# EasyEDA Pro project ProPrj_Syndra Version 2_2026-02-07.epro, board ControlBoard
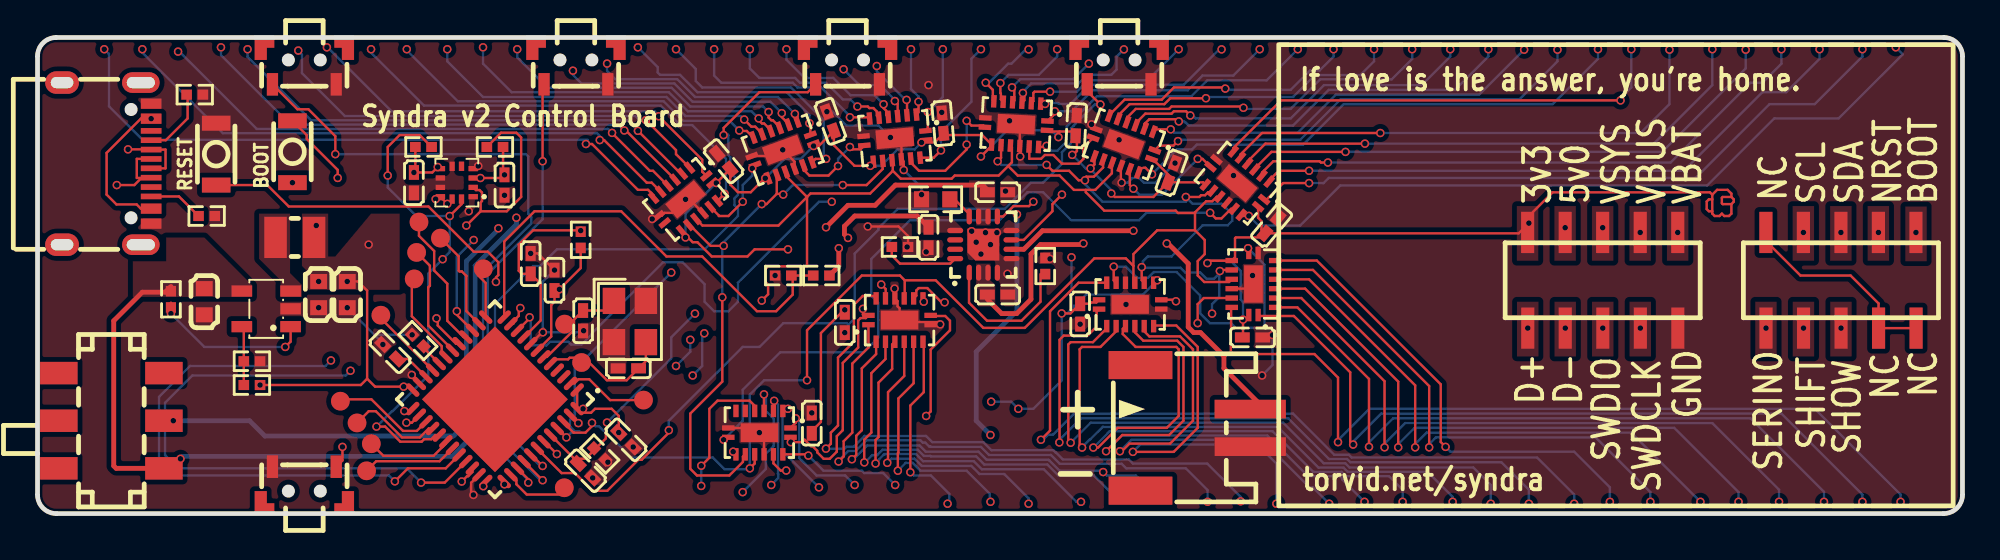
[diagram p4: board, top side]
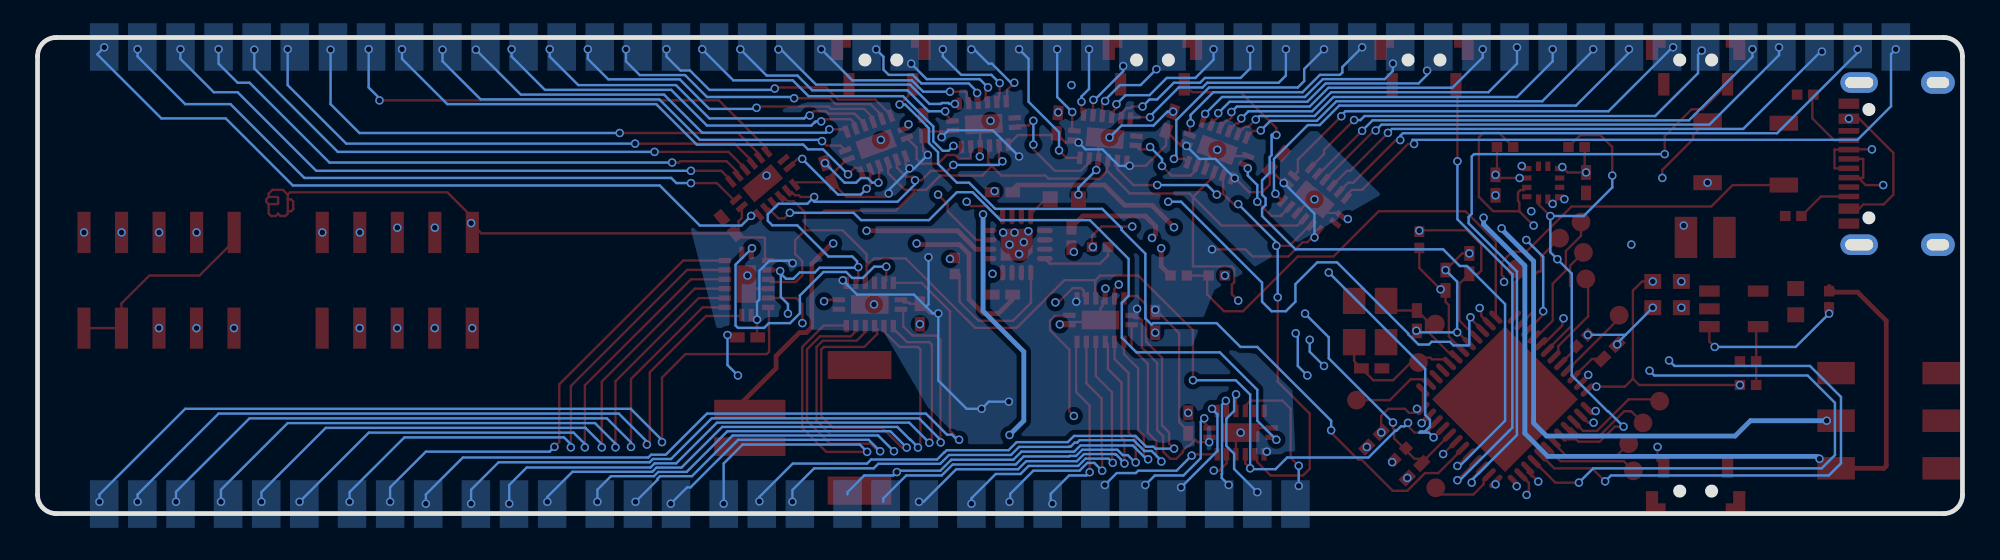
[diagram p5: board, bottom side, seen from below]

Outline 102.62 x 25.4 mm; copper layers: Top Layer, Inner1, Inner2, Bottom Layer. Coordinates in mm from the lower left corner of the outline.
Outline path: 0,24.4 0,1 arc(0.29,0.29) 1,0 101.62,0 arc(102.32,0.29) 102.62,1 102.62,24.4 arc(102.32,25.11) 101.62,25.4 1,25.4 arc(0.29,25.11) 0,24.4
Stack: Top Layer 0.035mm Outer layer thickness 1oz / Dielectric1 0.2104mm 7628 RC49% 8.6mil / Inner1 0.0152mm Inner layer thickness / Dielectric2 1.065mm 1.1mm H/HOZ Copper / Inner2 0.0152mm Inner layer thickness / Dielectric3 0.2104mm 7628 RC49% 8.6mil / Bottom Layer 0.035mm Outer layer thickness 1oz

## Design rules (mm)
template: Custom Config
spacing copperThickness1oz (default): track to track 0.102, other pairs 0.152 to 0.3
spacing copperThickness2oz: track to track 0.203, other pairs 0.152 to 0.3
spacing copperThicknessInner0.5oz: track to track 0.089, other pairs 0.152 to 0.3
track width copperThickness1oz (default): min 0.102, default 0.254, max 2.54
track width copperThickness2oz: min 0.203, default 0.254, max 2.54
track width copperThickness0.5oz: min 0.089, default 0.254, max 2.54
differential pair differentialPair (default): width min 0.127, default 0.254, max 2.54; gap min 0.152, default 0.152
via viaSize (default): diameter min 0.3, default 0.61, max 10; hole min 0.2, default 0.305, max 6.3
pour e13157 uses copperRegion

## Placement (name value [footprint] x y rotation side)
BOOT  GT-TC024A-H0060-L1  [SW-SMD_L3.0-W2.0-LS3.5]  13.59 19.3 90 top
C28  22uF  [C0603]  14.99 11.68 90 top
C29  22uF  [C0603]  16.51 11.68 90 top
C30  22uF  [C0603]  8.89 11.3 90 top
C36  10uF  [C0402]  43.03 10.2 90 top
C37  10uF  [C0402]  55.58 10.65 90 top
C38  10uF  [C0402]  41.28 4.83 270 top
C39  10uF  [C0402]  64.77 9.4 180 top
C40  10uF  [C0402]  36.58 18.8 310 top
C41  10uF  [C0402]  42.27 20.93 290 top
C42  10uF  [C0402]  48.26 20.83 275 top
C43  10uF  [C0402]  55.37 20.7 267.1 top
C44  10uF  [C0402]  60.45 18.19 250 top
C45  10uF  [C0402]  65.79 15.37 230 top
C50  2.2uF  [C0402]  18.8 8.64 315 top
C53  14pF  [C0402]  29.08 10.29 270 top
C54  14pF  [C0402]  31.5 7.75 180 top
C57  100nF  [C0402]  26.29 13.34 90 top
C60  100nF  [C0402]  31.37 3.94 315 top
C61  100nF  [C0402]  27.56 12.45 270 top
C62  100nF  [C0402]  29.21 2.29 315 top
C66  100nF  [C0402]  20.07 17.65 90 top
C67  100nF  [C0402]  24.89 17.53 90 top
C69  10uF  [C0402]  51.18 17.15 180 top
C70  10uF  [C0402]  47.5 14.73 270 top
C71  10uF  [C0402]  51.18 11.68 180 top
CN1  S2B-PH-SM4-TB(LF)(SN)  [CONN-SMD_P2.00_S2B-PH-SM4-TB-LF-SN]  61.72 4.57 270 top
IC1  TLV62569DBVR  [SOT-23-5_L3.0-W1.7-P0.95-LS2.8-BR]  12.19 10.92 0 top
L1  2.2uH  [IND-SMD_L2.5-W2.0]  13.72 14.73 0 top
P1  2.0-2*5P立贴母  [HDR-SMD_10P-P2.00-V-F-R2-C5-S2.00-LS6.0]  83.44 12.45 90 top
P2  2.0-2*5P立贴母  [HDR-SMD_10P-P2.00-V-F-R2-C5-S2.00-LS6.0]  96.14 12.45 90 top
R99  68kΩ  [R0402]  11.43 6.86 0 top
R100  15kΩ  [R0402]  11.43 8.13 180 top
R101  100kΩ  [R0402]  7.11 11.43 270 top
R115  10kΩ  [R0402]  28.96 14.61 90 top
R116  10kΩ  [R0402]  29.97 3.18 315 top
R117  10kΩ  [R0402]  20.28 9.23 315 top
R121  5.1kΩ  [R0402]  8.38 22.35 0 top
R122  5.1kΩ  [R0402]  9.02 15.88 0 top
R123  10kΩ  [R0402]  41.78 12.7 0 top
R124  10kΩ  [R0402]  39.75 12.7 0 top
R125  5.1kΩ  [R0402]  24.38 19.56 0 top
R126  5.1kΩ  [R0402]  20.57 19.56 180 top
R129  3kΩ  [R0603]  47.88 16.76 0 top
R130  4.7kΩ  [R0402]  45.97 14.22 180 top
R131  10kΩ  [R0402]  53.72 13.21 90 top
RESET  GT-TC024A-H0060-L1  [SW-SMD_L3.0-W2.0-LS3.5]  9.53 19.18 90 top
SW1  K3-2245S-L1  [SW-TH_K3-2245S-L1]  3.94 4.95 180 top
SW2  TS24CA  [SW-SMD_TS24CA]  14.22 23.88 0 top
SW3  TS24CA  [SW-SMD_TS24CA]  28.7 23.88 0 top
SW4  TS24CA  [SW-SMD_TS24CA]  43.18 23.88 0 top
SW5  TS24CA  [SW-SMD_TS24CA]  57.66 23.88 0 top
SW6  TS24CA  [SW-SMD_TS24CA]  14.22 1.52 180 top
TP10  -  [Test-Point-0.5mm]  17.03 4.84 0 top
TP11  -  [Test-Point-0.5mm]  16.14 5.99 0 top
TP12  -  [Test-Point-0.5mm]  18.3 10.58 0 top
TP13  -  [Test-Point-0.5mm]  20.08 12.52 0 top
TP14  -  [Test-Point-0.5mm]  20.21 13.93 0 top
TP15  -  [Test-Point-0.5mm]  28.08 1.38 0 top
TP16  -  [Test-Point-0.5mm]  17.54 2.28 0 top
TP19  -  [Test-Point-0.5mm]  17.8 3.73 0 top
TP20  -  [Test-Point-0.5mm]  20.33 15.55 0 top
TP21  -  [Test-Point-0.5mm]  21.48 14.7 0 top
TP22  -  [Test-Point-0.5mm]  23.76 13.06 0 top
TP23  -  [Test-Point-0.5mm]  29 8.06 0 top
TP24  -  [Test-Point-0.5mm]  28.1 10.11 0 top
TP25  -  [Test-Point-0.5mm]  32.31 6.05 0 top
U80  RS595SXTQW16  [DHVQFN-16_L3.5-W2.5-P0.50-BL-EP]  64.82 12.25 90 top
U81  RS595SXTQW16  [DHVQFN-16_L3.5-W2.5-P0.50-BL-EP]  58.25 11.16 0 top
U82  RS595SXTQW16  [DHVQFN-16_L3.5-W2.5-P0.50-BL-EP]  45.95 10.32 0 top
U83  RS595SXTQW16  [DHVQFN-16_L3.5-W2.5-P0.50-BL-EP]  38.48 4.32 180 top
U84  RS595SXTQW16  [DHVQFN-16_L3.5-W2.5-P0.50-BL-EP#2]  63.96 17.63 140 top
U85  RS595SXTQW16  [DHVQFN-16_L3.5-W2.5-P0.50-BL-EP#3]  57.91 19.71 160 top
U86  RS595SXTQW16  [DHVQFN-16_L3.5-W2.5-P0.50-BL-EP]  52.17 20.78 177.1 top
U87  RS595SXTQW16  [DHVQFN-16_L3.5-W2.5-P0.50-BL-EP]  45.7 20.03 185 top
U88  STM32F411CEU6  [UFQFPN-48_L7.0-W7.0-P0.50-BL-EP]  24.38 6.1 135 top
U90  RS595SXTQW16  [DHVQFN-16_L3.5-W2.5-P0.50-BL-EP#2]  39.73 19.41 200 top
U91  RS595SXTQW16  [DHVQFN-16_L3.5-W2.5-P0.50-BL-EP#3]  34.54 16.76 220 top
U92  KXTJ3-1057  [LGA-12_L2.0-W2.0-P0.50-BL]  22.35 17.65 90 top
U93  BQ24074RGTR  [QFN-16_L3.0-W3.0-P0.50-TL-EP1.7]  50.42 14.35 90 top
USB1  TYPE-C 16PIN 2MD(073)  [USB-C-SMD_TYPE-C-6PIN-2MD-073]  3.68 18.67 270 top
X1  24MHz  [CRYSTAL-SMD_4P-L3.2-W2.5-BL]  31.58 10.25 270 top

## Footprints (pads in the part's own frame, mm; a bottom-side part is the same pattern mirrored in y, then rotated)
C0402
  rect 0.79x0.54 smd: 1(-0.545,0) 2(0.545,0)
C0603
  rect 0.8x0.9 smd: 1(-0.7,0) 2(0.7,0)
CONN-SMD_P2.00_S2B-PH-SM4-TB-LF-SN
  rect 1x3.8 smd: 1(-1,2.925) 2(1,2.925)
  rect 1.5x3.4 smd: 3(3.35,-2.925) 4(-3.35,-2.925)
CRYSTAL-SMD_4P-L3.2-W2.5-BL
  rect 1.4x1.2 smd: 1(-1.1,-0.85) 2(1.1,-0.85) 3(1.1,0.85) 4(-1.1,0.85)
DHVQFN-16_L3.5-W2.5-P0.50-BL-EP
  rect 0.665x0.28 smd: 1(-1.657,-0.25) 8(1.657,-0.25) 9(1.657,0.25) 16(-1.657,0.25)
  rect 0.28x0.665 smd: 2(-1.25,-1.157) 3(-0.75,-1.157) 4(-0.25,-1.157) 5(0.25,-1.157) 6(0.75,-1.157) 7(1.25,-1.157) 10(1.25,1.157) 11(0.75,1.157) 12(0.25,1.157) 13(-0.25,1.157) 14(-0.75,1.157) 15(-1.25,1.157)
  rect 2x1 smd: 17(0,0)
DHVQFN-16_L3.5-W2.5-P0.50-BL-EP#2
  rect 0.665x0.28 smd: 1(-1.657,-0.25) 8(1.657,-0.25) 9(1.657,0.25) 16(-1.657,0.25)
  rect 0.28x0.665 smd: 2(-1.25,-1.157) 3(-0.75,-1.157) 4(-0.25,-1.158) 5(0.25,-1.157) 6(0.75,-1.157) 7(1.25,-1.157) 10(1.25,1.157) 11(0.75,1.157) 12(0.25,1.158) 13(-0.25,1.157) 14(-0.75,1.157) 15(-1.25,1.157)
  rect 2x1 smd: 17(0,0)
DHVQFN-16_L3.5-W2.5-P0.50-BL-EP#3
  rect 0.665x0.28 smd: 1(-1.657,-0.25) 8(1.657,-0.25) 9(1.657,0.25) 16(-1.657,0.25)
  rect 0.28x0.665 smd: 2(-1.25,-1.157) 3(-0.75,-1.157) 4(-0.25,-1.157) 5(0.25,-1.157) 6(0.75,-1.157) 7(1.25,-1.157) 10(1.25,1.157) 11(0.75,1.157) 12(0.25,1.157) 13(-0.25,1.157) 14(-0.75,1.157) 15(-1.25,1.157)
  rect 2x1 smd: 17(0,0)
HDR-SMD_10P-P2.00-V-F-R2-C5-S2.00-LS6.0
  rect 2.2x0.7 smd: 1(-2.552,3.997) 2(2.552,4.003) 3(-2.552,1.997) 4(2.552,2.003) 5(-2.552,-0.003) 6(2.552,0.003) 7(-2.552,-2.003) 8(2.552,-1.997) 9(-2.552,-4.003) 10(2.552,-3.997)
IND-SMD_L2.5-W2.0
  rect 1.2x2.2 smd: 1(1.028,0) 2(-1.028,0)
LGA-12_L2.0-W2.0-P0.50-BL
  rect 0.28x0.5 smd: 1(-0.75,-0.875) 2(-0.25,-0.875) 3(0.25,-0.875) 4(0.75,-0.875) 7(0.75,0.875) 8(0.25,0.875) 9(-0.25,0.875) 10(-0.75,0.875)
  rect 0.5x0.28 smd: 5(0.875,-0.25) 6(0.875,0.25) 11(-0.875,0.25) 12(-0.875,-0.25)
QFN-16_L3.0-W3.0-P0.50-TL-EP1.7
  oval 0.85x0.28 smd: 1(-1.5,0.75) 2(-1.5,0.25) 3(-1.5,-0.25) 4(-1.5,-0.75) 9(1.5,-0.75) 10(1.5,-0.25) 11(1.5,0.25) 12(1.5,0.75)
  oval 0.28x0.85 smd: 5(-0.75,-1.5) 6(-0.25,-1.5) 7(0.25,-1.5) 8(0.75,-1.5) 13(0.75,1.5) 14(0.25,1.5) 15(-0.25,1.5) 16(-0.75,1.5)
  custom 1.7x1.7 smd: 17(0,0)
R0402
  rect 0.566x0.54 smd: 1(-0.433,0) 2(0.433,0)
R0603
  rect 0.806x0.864 smd: 1(-0.753,0) 2(0.753,0)
SOT-23-5_L3.0-W1.7-P0.95-LS2.8-BR
  rect 1.1x0.6 smd: 1(1.3,-0.95) 2(1.3,0) 3(1.3,0.95) 4(-1.3,0.95) 5(-1.3,-0.95)
SW-SMD_L3.0-W2.0-LS3.5
  rect 0.8x1.524 smd: 1(-1.651,0) 2(1.651,0)
SW-SMD_TS24CA
  custom 1.05x1.3 smd: 1(-2.125,0.975) 2(2.125,0.975)
  rect 0.6x1.2 smd: 3(-1.7,-0.975) 4(1.7,-0.975)
SW-TH_K3-2245S-L1
  rect 2x1.2 smd: 1(-2.8,2.54) 2(-2.8,0) 3(-2.8,-2.54) 4(2.8,-2.54) 5(2.8,0) 6(2.8,2.54)
Test-Point-0.5mm
  round 1 smd: 1(0,0)
UFQFPN-48_L7.0-W7.0-P0.50-BL-EP
  oval 0.28x0.9 smd: 1(-2.751,-3.45) 2(-2.251,-3.45) 3(-1.75,-3.45) 4(-1.25,-3.45) 5(-0.749,-3.45) 6(-0.249,-3.45) 7(0.249,-3.45) 8(0.75,-3.45) 9(1.25,-3.45) 10(1.75,-3.45) 11(2.251,-3.45) 12(2.751,-3.45) 25(2.751,3.449) 26(2.251,3.449) 27(1.75,3.449) 28(1.25,3.449) 29(0.75,3.449) 30(0.249,3.449) 31(-0.249,3.449) 32(-0.749,3.449) 33(-1.25,3.449) 34(-1.75,3.449) 35(-2.251,3.449) 36(-2.751,3.449)
  oval 0.9x0.28 smd: 13(3.45,-2.751) 14(3.45,-2.251) 15(3.45,-1.75) 16(3.45,-1.25) 17(3.45,-0.75) 18(3.45,-0.249) 19(3.45,0.249) 20(3.45,0.749) 21(3.45,1.25) 22(3.45,1.75) 23(3.45,2.251) 24(3.45,2.751) 37(-3.449,2.751) 38(-3.449,2.251) 39(-3.449,1.75) 40(-3.449,1.25) 41(-3.449,0.749) 42(-3.449,0.249) 43(-3.449,-0.249) 44(-3.449,-0.75) 45(-3.449,-1.25) 46(-3.449,-1.75) 47(-3.449,-2.251) 48(-3.449,-2.751)
  rect 5.5x5.5 smd: 49(0,0)
USB-C-SMD_TYPE-C-6PIN-2MD-073
  rect 0.55x1.1 smd: 1(-3.2,2.375) 2(-2.4,2.375) 11(2.4,2.375) 12(3.2,2.375)
  rect 0.3x1.1 smd: 3(-1.75,2.375) 4(-1.25,2.375) 5(-0.75,2.375) 6(-0.25,2.375) 7(0.25,2.375) 8(0.75,2.375) 9(1.25,2.375) 10(1.75,2.375)
  oval 1.1x2 hole 0.6x1.5: 13(-4.325,1.825) 14(4.325,1.825)
  oval 1.2x1.8 hole 0.6x1.2: 13(-4.325,-2.375) 14(4.325,-2.375)

## Nets
As in the schematic.

Pads without a net: CN1 3 4; P2 2 7 9; SW1 3 4 5 6; SW2 1 2; SW3 1 2; SW4 1 2; SW5 1 2; SW6 1 2; U88 3 4 49; U91 9; U92 5; U93 14 15; USB1 3 9 13 14

## Via types
v1: diameter 0.45, hole 0.3, Top Layer to Bottom Layer, 361 vias

## Routing (per net, layer and track width the routed paths; a pad name or vN(x,y) marks a point on that pad's centre or on a via; arc(x,y) is an arc through that point)
3.3V: length 227
  Top Layer w0.127: v1(28.96,15.1) 28.94,15.11 26.42,15.11 25.65,14.35 25.65,12.95 25.82,12.79 C57.1 26.82,12.26 26.82,10.3 U88.9 ; 79.44,15.43 78.96,14.95 C45.2 ; 79.44,15.43 P1.2 ; 79.44,15.43 v1(79.5,15.49) ; 79.44,15.43 79.44,15.81 80.77,17.14 89.15,17.14 89.28,17.01 ; v1(64.26,10.35) 64.26,9.44 64.22,9.4 ; v1(44,10.92) 44,10.61 44.04,10.57 U82.16 44.15,10.43 43.87,10.43 43.75,10.3 43.75,8.86 42.93,8.04 42.93,4.45 42.61,4.13 42.61,3.3 42.23,2.92 41.91,2.92 41.56,3.27 41.56,3.35 41.32,3.59 41.24,3.59 40.89,3.94 40.77,3.81 v1(40.16,3.81) ; v1(50.29,19.05) 50.86,19.62 U86.10 50.36,20.19 48.4,20.19 48.31,20.29 47.82,19.8 v1(47.12,19.8) ; U91.16 v1(36.19,17.64) C40.2 36.93,17.56 37.34,17.15 38.02,17.15 38.77,17.89 v1(38.79,17.89) ; 54.5,20.38 53.92,20.38 53.91,20.38 53.88,20.38 U86.16 ; 54.5,20.38 54.42,20.31 v1(54.42,20.08) ; 54.5,20.38 55.12,20.38 55.41,20.09 55.41,19.34 55.25,19.18 55.12,19.18 ; v1(59.69,12.45) 59.63,12.45 U81.10 ; 34.33,15.07 34.93,14.48 35.18,14.48 35.94,13.72 37.85,13.72 38.23,14.1 v1(40,14.1) ; v1(11.86,6.86) 17.23,6.86 17.57,7.19 ; 89.28,17.01 89.53,17.27 90.1,17.27 90.3,17.07 90.3,16.89 ; 89.28,17.01 89.28,16.76 ; 90.3,16.89 90.42,16.76 90.42,16.64 90.3,16.51 ; 90.3,16.89 89.83,16.89 89.79,16.85 89.79,16.56 89.83,16.51 90.3,16.51 ; v1(62.36,13.36) 62.49,13.49 63.65,13.49 U80.10 63.84,13.67 63.84,14.69 63.88,14.73 65.22,14.73 C45.2 ; 54.42,20.21 54.37,20.21 54.36,20.2 ; 89.28,16.13 89.1,16.13 88.98,16.24 88.98,16.65 89.1,16.76 89.28,16.76 ; 89.28,16.13 89.28,16.01 89.41,15.88 89.66,15.88 89.79,16 89.92,15.88 90.17,15.88 90.3,16 90.3,16.51 ; 89.28,16.13 89.28,16.76 ; v1(56.13,18.42) 56.34,18.62 U85.10 ; v1(19.52,6.77) 17.99,6.77 17.57,7.19 ; R125.2 24.82,18.15 v1(24.89,18.07) 24.72,17.9 v1(23.61,17.9) ; C45.2 65.25,15.14 65.25,15.6 65.07,15.78 U84.16 ; v1(21.85,16.52) 21.6,16.78 v1(21.22,16.78) ; U85.16 59.39,18.92 59.45,18.92 60.48,17.89 60.52,17.93 ; R126.2 20.14,18.27 v1(20.07,18.2) 21.04,18.2 v1(21.33,18.49) ; U88.1 U88.48 28.99,5.38 29.51,5.38 29.72,5.59 30.61,5.59 30.99,5.21 30.99,4.33 v1(30.98,4.32) ; 17.57,7.19 17.57,11.89 17.08,12.38 v1(16.51,12.38) ; v1(44.39,18.55) 43.55,18.55 42.45,19.65 C41.2 41.65,19.61 v1(41.37,19.61) ; U81.16 56.44,11.26 56.17,11.26 56.1,11.19 C37.2 55.06,10.68 v1(54.6,10.68) ; v1(57.24,17.08) 57.43,16.89 59.48,16.89 C44.2 62.13,17.67 U84.10 ; C38.2 41.28,4.4 41.76,4.89 41.76,9.63 43,10.87 v1(43.03,10.87)
  Inner1 w0.127: v1(44,10.92) 44,10.98 44.07,11.05 46.48,11.05 46.74,11.3 v1(47.24,11.3) ; v1(34.54,14.73) 29.32,14.73 v1(28.96,15.1) ; v1(59.69,12.45) 61.45,12.45 v1(62.36,13.36) ; v1(37.08,3.3) 39.65,3.3 v1(40.16,3.81) ; v1(55.12,13.67) 54.69,14.1 53.78,14.1 53.72,14.03 52.32,14.03 50.87,12.57 49.97,12.57 48.14,14.4 47.19,14.4 46.5,13.72 40.39,13.72 v1(40,14.1)
  Inner1 w0.254: v1(13.59,17.65) 14.86,16.38 v1(14.86,15.37)
  Inner2 w0.127: v1(24.89,18.07) 25.98,18.07 v1(28.96,15.1) ; 27.89,5.59 26.71,6.77 22.33,6.77 19.93,4.37 19.53,4.37 18.97,4.92 18.97,5.76 19.52,6.31 v1(19.52,6.77) ; 27.89,5.59 v1(29.08,5.59) ; 27.89,5.59 v1(23.76,1.46)
  Bottom Layer w0.127: v1(62.36,13.36) 62.49,13.49 63.6,13.49 64.13,12.95 64.13,11.42 64.26,11.29 v1(64.26,10.35) ; v1(47.12,19.8) 46.76,19.43 45.85,19.43 44.97,18.55 v1(44.39,18.55) ; v1(54.42,20.08) 54.06,20.45 51.69,20.45 v1(50.29,19.05) ; v1(50.84,5.97) 51.91,5.97 v1(52.29,5.59) 53.09,5.59 54.6,7.1 v1(54.6,10.68) 54.89,10.68 55.25,11.03 ; v1(36.19,17.64) 36.18,17.64 34.54,16 v1(34.54,14.73) ; v1(55.16,19.14) 55.88,18.42 v1(56.13,18.42) 56.13,18.37 57.24,17.26 v1(57.24,17.08) ; 55.25,11.03 55.12,11.16 v1(55.12,13.67) ; 55.25,11.03 55.9,11.68 58.93,11.68 v1(59.69,12.45) ; v1(38.79,17.89) 39.83,18.92 40.68,18.92 v1(41.37,19.61)
  vias: v1(14.99,12.38) v1(17.65,14.35)
5.0V: length 114.2
  Top Layer w0.254: SW1.1 4.19,2.41 4.06,2.54 4.06,10.29 5.59,11.81 6.81,11.81 7.11,12.12
  Inner1 w0.254: v1(25.53,15.78) 26,16.26 33.66,16.26 34.04,15.88 42.54,15.88 43.14,16.47 51.7,16.47 v1(52.21,15.96) 52.38,16.13 59.93,16.13 60.18,15.88 61.24,15.88 62.25,16.89 66.93,16.89 68.16,15.66 76.17,15.66 76.84,14.99 81.17,14.99 v1(81.44,15.25)
  Bottom Layer w0.254: v1(25.53,15.78) 25.53,15.42 23.33,13.23 23.33,4.28 22.1,3.05 7.75,3.05 v1(7.62,2.92) ; v1(52.21,15.96) 52.21,10.81 50.04,8.64 50.04,4.95 v1(50.8,4.19)
GND: length 75.5
  Top Layer w0.127: v1(46.18,18.33) 46.18,18.56 46.17,18.57 46.17,18.78 46.05,18.9 46.05,19.68 U87.17 ; v1(52.38,19.05) 52.38,19.59 U86.13 52.36,20.59 U86.17 ; v1(26.29,13.88) 26.67,13.88 v1(27.56,12.99) ; U91.8 33.28,15.89 33.43,16.04 33.82,16.04 v1(34.54,16.76) 34.75,16.76 U91.13 ; U82.13 45.85,11.34 45.85,11.06 45.95,10.95 U82.17 46.06,10.22 47.99,10.22 v1(48.12,10.09) ; v1(26.94,9.67) 26.9,9.67 26.29,9.07 ; v1(23.24,0.99) 23.24,1.02 23.11,1.14 23.11,1.64 U88.35 ; 46.41,14.22 46.41,14.81 45.9,15.32 v1(44.26,15.32) ; U83.8 38.23,4.57 v1(38.48,4.32) 38.73,4.07 U83.13 ; 57.75,18.54 57.75,17.69 v1(57.79,17.65) ; U88.23 20.35,7 v1(19.95,7.4) ; U80.13 64.57,12 U80.17 ; U90.13 40.36,18.78 v1(39.73,19.41) 39.39,19.07 U90.8
  Inner1 w0.127: v1(47.5,22.86) 47.5,22.01 47.9,21.61 47.9,21.24 47.64,20.98 46.38,20.98 v1(45.47,20.07) ; v1(52.38,19.05) 52.38,17.99 v1(51.6,17.2) ; v1(31.75,3.55) 30.94,2.74 v1(30.41,2.74) 30.41,3.25 v1(28.83,4.83)
  Inner2 w0.127: v1(47.13,17.02) 47.13,14.21 v1(47.37,13.96) 46.62,13.96 ; 46.62,13.96 45.69,13.03 v1(45.69,12) ; 46.62,13.96 v1(46.35,14.22) ; v1(58.03,11.16) 56.97,10.1 v1(55.58,10.1) 55.58,11.98 v1(53.97,13.59) 53.18,12.79 v1(51.71,12.79)
  Bottom Layer w0.127: v1(65.84,9.53) 65.84,7.92 v1(65.28,7.37) ; v1(18.41,9.02) 18.41,9.08 17.96,9.54 ; v1(27.56,12.99) 26.94,12.37 v1(26.94,9.67) 29.03,9.67 v1(29.11,9.75) ; v1(16.51,10.98) 17.96,9.54 ; 17.96,9.54 v1(19.97,9.54) ; v1(57.79,17.65) 58.12,17.65 58.36,17.9 58.73,17.9 58.98,17.65 59.59,17.65 v1(60.64,18.7) ; v1(46.18,18.33) 47.13,17.38 v1(47.13,17.02) ; v1(42.08,21.44) 42.38,21.44 43.12,20.7 44.83,20.7 v1(45.47,20.07)
  vias: v1(14.99,10.98) v1(22.99,16.13) v1(23.5,18.54) v1(24.89,16.98) v1(29.6,1.9) v1(32.77,15.72) v1(39.32,12.7) v1(41.28,5.37) v1(43.03,9.65) v1(48.2,21.41) v1(49.8,15.07) v1(50.04,14.48) v1(50.29,13.84) v1(50.53,14.99) v1(50.8,14.35) v1(51.14,14.99) v1(51.82,20.96) v1(56.19,20.77) v1(57.66,19.94) v1(63.75,18.03) v1(64.77,12.7)
VBAT: length 70
  Top Layer w0.254: 50.64,11.43 51.4,10.67 52.2,10.67 52.96,11.43 52.96,13.84 53.47,14.35 55.69,14.35 v1(55.75,14.41) ; v1(42.72,14.16) 42.72,13.2 R123.2 ; 66.04,5.57 65.42,5.57 63.25,7.75 63.25,8.41 62,9.66 61.64,9.66 61.34,9.95 61.34,13.34 60.27,14.41 v1(60.2,14.41)
  Inner1 w0.254: v1(42.72,14.16) 42.77,14.1 45.21,14.1 45.85,14.73 48.23,14.73 50,12.95 50.83,12.95 52.29,14.41 v1(55.75,14.41) v1(60.2,14.41) 60.39,14.61 63.5,14.61 63.88,14.99 65.91,14.99 66.93,13.97 75.44,13.97 76.19,13.22 85.66,13.22 v1(87.44,15)
VBUS: length 110.4
  Top Layer w0.127: USB1.11 5.51,16.27 5.28,16.49 4.21,16.49 3.68,17.02 3.68,19.25 5.51,21.07 v1(6.06,21.07)
  Top Layer w0.254: v1(58.42,15.09) 53.57,15.09 52.58,14.1 U93.6 ; v1(43.21,14.71) 43.01,14.9 43.01,15.33 43.56,15.88 46.9,15.88 C70.1
  Inner1 w0.127: 5.97,21.08 6.07,21.08 v1(6.06,21.07)
  Inner1 w0.254: 6.07,21.08 15.49,21.08 16.26,20.32 17.02,20.32 17.22,20.12 25.09,20.12 25.4,19.81 25.4,16.76 23.88,15.24 23.88,14.99 24.24,14.62 28.05,14.62 28.45,14.22 34.8,14.22 35.43,14.86 41.7,14.86 41.85,14.71 v1(43.21,14.71) 43.43,14.48 44.83,14.48 45.72,15.37 46.86,15.37 47.12,15.62 51.31,15.62 51.85,15.09 v1(58.42,15.09) 58.52,14.99 62.99,14.99 63.37,15.37 66.8,15.37 67.69,14.48 76.07,14.48 76.84,13.72 84.15,13.72 v1(85.44,15)
(no net): length 11.2
  Top Layer w0.127: P2.9 P2.7 98.14,11.21 96.65,12.7 93.98,12.7 92.14,14.54 P2.2
ACC_SCL: length 102.5
  Top Layer w0.127: R126.1 20.37,20.19 19.3,20.19 18.67,19.56 v1(18.67,18.03) ; U92.12 22.6,16.51 v1(21.97,15.88) ; U88.29 21.21,4.19 20.99,3.97 20.61,3.97 20.47,3.84 19.34,3.84 18.53,4.64 v1(18.07,4.64)
  Inner1 w0.127: v1(21.6,13.57) 25.98,13.57 26.11,13.44 26.47,13.44 26.6,13.57 28.59,13.57 28.86,13.3 35.22,13.3 35.38,13.46 48.76,13.46 49.9,12.32 52.83,12.32 52.83,12.32 53.55,12.32 54.24,13.01 55.74,13.01 56.57,13.84 61.53,13.84 61.71,14.03 63,14.03 63.59,13.44 74.96,13.44 75.56,12.83 92.42,12.83 94.14,14.54 v1(94.14,15)
  Bottom Layer w0.127: v1(18.67,18.03) 18.67,17.4 20.19,15.88 v1(21.97,15.88) 21.97,13.95 v1(21.6,13.57) 20.83,12.8 20.83,7.37 18.92,5.46 18.89,5.46 v1(18.07,4.64)
ACC_SDA: length 105.2
  Top Layer w0.127: 23.62,16.13 25.02,16.13 25.78,16.89 25.78,20.07 25.53,20.32 24.71,20.32 R125.1 ; 23.62,16.13 23.62,16.55 ; 23.62,16.13 v1(22.86,15.37) ; 27.71,4.54 27.72,4.54 v1(28.19,4.06) ; 23.62,16.6 23.69,16.67 23.69,17.13 23.57,17.26 23.37,17.26 U92.2
  Inner1 w0.127: 33.69,12.95 v1(33.78,12.86) ; 33.69,12.95 33.54,12.8 28.21,12.8 27.85,12.45 25.78,12.45 25.15,13.08 21.46,13.08 21.08,13.46 21.08,14.73 21.72,15.37 v1(22.86,15.37) ; 33.69,12.95 35.43,12.95 35.71,13.23 48.66,13.23 49.83,12.07 52.9,12.07 52.93,12.09 54.41,12.09 54.89,12.57 55.63,12.57 56.67,13.61 61.62,13.61 61.81,13.8 62.91,13.8 63.5,13.21 65.91,13.21 66.04,13.08 74.29,13.08 74.8,12.57 93.71,12.57 v1(96.14,15)
  Bottom Layer w0.127: v1(28.19,4.06) 28.45,4.32 28.96,4.32 28.89,4.39 28.65,4.39 28.39,4.64 28.39,5.01 28.65,5.27 28.65,5.4 28.64,5.41 28.64,7.72 v1(33.78,12.86)
B0: length 37.4
  Top Layer w0.127: U80.2 67.16,11 70.98,7.18 v1(70.98,3.56)
  Bottom Layer w0.127: v1(95.23,0.63) 95.23,1.16 91.31,5.08 72.26,5.08 70.98,3.8 v1(70.98,3.56)
B1: length 30.3
  Top Layer w0.127: U80.5 67.78,12.5 73.44,6.84 v1(73.44,3.53)
  Bottom Layer w0.127: v1(73.44,3.53) 73.44,3.72 74.04,4.32 84.96,4.32 v1(88.65,0.63)
B2: length 42
  Top Layer w0.127: U81.15 55.49,12.31 53.97,10.8 53.97,4.42 v1(53.49,3.94)
  Bottom Layer w0.127: v1(81.91,0.53) 81.91,1.02 79.94,2.99 70.05,2.99 69.91,3.14 69.12,3.14 66.93,5.33 55.26,5.33 54.13,4.21 53.87,4.21 53.6,3.94 v1(53.49,3.94)
B3: length 29.9
  Top Layer w0.127: v1(55.68,3.52) 55.55,3.65 55.55,8.76 55.68,8.89 56.66,8.89 57.5,9.72 U81.3
  Bottom Layer w0.127: v1(75.44,0.63) 75.44,0.89 74.1,2.23 69.84,2.23 69.62,2.45 68.29,2.45 66.12,4.62 56.78,4.62 56.12,3.96 56.1,3.96 55.68,3.54 v1(55.68,3.52)
B4: length 24.3
  Top Layer w0.127: 58.93,9.75 58.97,9.75 59.27,9.45 60.91,9.45 61.59,8.76 61.59,4.95 60.37,3.73 58.21,3.73 57.8,3.32 v1(57.7,3.32)
  Bottom Layer w0.127: v1(68.86,0.53) 67.99,1.4 67.81,1.4 65.27,3.94 58.31,3.94 v1(57.7,3.32)
B5: length 29.9
  Top Layer w0.127: U82.1 44.3,8.86 43.43,8 43.43,4.32 42.97,3.86 42.97,3.05 v1(42.7,2.78)
  Bottom Layer w0.127: v1(42.7,2.78) 42.7,2.82 43.22,3.34 43.61,3.34 44.18,3.91 47.06,3.91 47.19,3.79 47.33,3.79 47.53,3.58 47.6,3.58 47.62,3.56 50.29,3.56 50.72,3.13 54.02,3.13 54.5,2.66 57.8,2.66 58.04,2.41 61.21,2.41 62.37,1.25 v1(62.37,0.63)
B6: length 19.2
  Top Layer w0.127: v1(44.68,2.67) 44.68,3.92 44.83,4.08 44.83,6.98 45.56,7.71 45.56,9.02 U82.4
  Bottom Layer w0.127: v1(55.63,0.63) 55.38,0.63 53.64,2.36 50.34,2.36 49.91,2.79 47.21,2.79 46.83,3.18 45.18,3.18 45.15,3.15 45.12,3.15 44.86,2.89 44.86,2.85 v1(44.68,2.67)
B7: length 10.4
  Top Layer w0.127: U82.7 47.24,9.13 47.24,6.48 46.53,5.76 v1(46.53,2.21)
  Bottom Layer w0.127: v1(46.53,2.21) 46.7,2.03 47.62,2.03 48.61,1.05 48.61,0.62 v1(48.51,0.53)
B8: length 5.4
  Top Layer w0.127: U83.2 39.84,5.59 v1(40,5.59)
  Bottom Layer w0.127: v1(41.66,1.4) 39.72,3.34 39.72,5.3 v1(40,5.59)
B9: length 7.3
  Top Layer w0.127: U83.5 38.23,5.75 37.96,6.02 36.25,6.02 35.81,5.59 35.81,2.98 v1(35.38,2.55)
  Bottom Layer w0.127: v1(35.38,1.47) 35.38,2.55 v1(35.38,2.55)
BATSENS: length 24.9
  Top Layer w0.127: R123.1 R124.2 40.26,12.62 40.26,11.68 39.37,10.8 38.35,10.8 35.43,13.72 33.53,13.72 31.12,16.13 26.5,16.13 24.88,14.51 U88.12
BOOT: length 107.4
  Top Layer w0.127: BOOT.2 14.35,20.19 14.35,19.99 16,18.34 v1(16,17.91) ; v1(30.36,4.86) 30.36,4.56 30.3,4.5 30.3,4.01 29.21,2.93 28.57,2.93 28.57,2.97 U88.44
  Inner1 w0.127: v1(100.14,15) 97.2,12.07 73.41,12.07 73.11,11.77 59.41,11.77 59.28,11.89 56.15,11.89 55.89,11.63 53.12,11.63 52.91,11.43 49.66,11.43 49.19,11.89 49.14,11.89 48.25,12.78 43.38,12.78 42.43,11.82 39.11,11.82 38.92,12.01 35.63,12.01 35.05,11.42 v1(35.05,10.67) 28.59,10.67 27.74,11.52 27.4,11.52 27.36,11.56 22.35,11.56 v1(16,17.91)
  Bottom Layer w0.127: v1(35.05,10.67) 33.78,9.4 33.78,8.28 v1(30.36,4.86)
BUTTON0: length 36.3
  Top Layer w0.127: SW2.3 13.86,21.57 14.44,21.57 15.88,20.14 v1(15.88,19.18) ; U88.39 25.59,2.41 26.16,1.83 v1(26.16,1.65)
  Bottom Layer w0.127: v1(26.16,1.65) 26.16,1.78 23.75,4.19 23.75,12.91 26.32,15.48 26.32,15.83 26.16,15.99 26.16,19.05 26.03,19.18 v1(15.88,19.18)
BUTTON1: length 25.1
  Top Layer w0.127: v1(26.92,18.8) 26.92,22.82 SW3.3 ; v1(26.92,1.78) 25.94,2.76 U88.40
  Bottom Layer w0.127: v1(26.92,1.78) 26.8,1.78 24,4.58 24,12.77 26.92,15.7 v1(26.92,18.8)
BUTTON2: length 36.8
  Top Layer w0.127: v1(36.58,20.19) 36.58,20.57 38.48,22.48 41.06,22.48 SW4.3 ; 26.29,3.13 26.34,3.13 v1(26.92,2.54)
  Bottom Layer w0.127: v1(26.92,2.54) 26.8,2.54 24.38,4.95 24.38,11.18 26.42,13.21 26.8,13.21 27.69,14.1 35.56,14.1 37.34,15.88 37.34,16.27 37.15,16.45 37.15,16.82 37.34,17.01 37.34,17.78 36.93,18.19 36.93,19.02 36.83,19.12 36.83,20.19 36.78,20.24 36.62,20.24 v1(36.58,20.19)
BUTTON3: length 44.2
  Top Layer w0.127: v1(33.66,4.45) 33.66,4.32 32.2,2.87 32.02,2.87 30.37,1.22 29.59,1.22 28.65,2.16 27.94,2.16 26.65,3.45 26.65,3.48 ; SW5.3 56.13,22.73 56.13,22.35 v1(56.66,21.83)
  Bottom Layer w0.127: v1(56.66,21.83) 56.36,21.83 55.25,20.71 55.25,20.7 55.09,20.55 55.09,19.76 54.61,19.28 54.61,18.66 53.61,17.65 52.96,17.65 51.56,16.26 45.86,16.26 44.83,15.23 44.83,15.13 43.56,13.87 43.56,10.41 43.23,10.08 43.22,10.08 43.15,10.16 39.76,10.16 38.49,8.89 37.59,8.89 33.66,4.95 v1(33.66,4.45)
BUTTON4: length 16
  Top Layer w0.127: v1(27.69,3.18) 27.03,3.83 27,3.83 ; 15.92,2.5 16.26,2.83 v1(16.26,3.56)
  Inner1 w0.127: v1(27.69,3.18) 24,3.18 23.13,2.3 23.13,1.51 22.89,1.27 22.8,1.27 22.54,1.02 18.92,1.02 16.38,3.56 v1(16.26,3.56)
CHRG_STAT1: length 52.1
  Top Layer w0.127: v1(19.67,4.85) 19.96,4.85 U88.26 ; U93.7 52.57,14.6 54.1,16.13 54.1,16.51 v1(54.61,17.02) ; U88.10 26.23,10.42 v1(26.23,10.47)
  Inner1 w0.127: v1(54.61,17.02) 54.55,17.08 52.9,17.08 52.59,16.76 49.91,16.76 48.9,17.78 44.58,17.78 43.81,17.02 42.72,17.02 v1(42.34,16.64)
  Inner2 w0.127: v1(26.23,10.47) 24.02,8.26 23.5,8.26 20.09,4.85 v1(19.67,4.85)
  Bottom Layer w0.127: v1(42.34,16.64) 41.66,16.64 37.34,12.32 37.34,11.3 36.83,10.8 36.07,10.8 35.56,11.3 35.56,12.24 34.39,13.4 33.34,13.4 29.55,9.61 29.55,9.57 29,9.02 28.45,9.02 28.3,9.16 27.32,9.16 27.13,8.97 26.33,8.97 26.29,9.02 26.29,10.41 v1(26.23,10.47)
CHRG_STAT2: length 43.4
  Top Layer w0.127: v1(53.09,16.64) 52.85,16.4 52.03,16.4 51.48,15.85 U93.9 ; v1(25.74,10.97) 25.65,10.88 25.65,10.55 25.36,10.25 25.36,10.13 U88.11
  Inner2 w0.127: v1(53.09,16.64) 52.83,16.38 52.83,14.56 49.98,11.71 48.17,11.71 47.91,11.45 47.91,11.35 47.43,10.86 47.06,10.86 46.56,11.36 42.35,11.36 41.78,10.8 36.07,10.8 35.69,11.18 34.42,11.18 34.21,10.97 v1(25.74,10.97) 25.05,10.97 v1(19.56,5.47)
D+: length 125.5
  Top Layer w0.127: USB1.8 6.05,17.91 5.54,17.91 ; 5.54,17.91 5.29,17.91 5.29,18.92 6.05,18.92 USB1.6 ; 5.54,17.91 5.16,17.53 v1(4.23,17.53) ; U88.33 21.71,1.65 v1(20.45,1.65)
  Inner1 w0.127: v1(79.44,9.89) 79.07,9.53 77.47,9.53 76.33,8.38 33.02,8.38 32.26,7.62 20.35,7.62 20.13,7.84 19.77,7.84 19.55,7.62 v1(16.68,7.62) 13.21,7.62 12.3,6.72 12.3,6.68 12.05,6.42 12.01,6.42 9.65,4.06 6.65,4.06 6.14,4.57 5.46,4.57 3.43,6.6 3.43,16.73 v1(4.23,17.53)
  Bottom Layer w0.127: v1(16.68,7.62) 16.43,7.37 8.25,7.37 6.8,5.91 6.8,3.12 7.5,2.41 19.69,2.41 v1(20.45,1.65)
D-: length 122.1
  Top Layer w0.127: v1(19.05,1.72) 19.74,2.41 21.76,2.41 22.47,3.13 ; v1(4.83,19.43) 6.05,19.43 USB1.5 6.82,19.42 6.82,18.42 USB1.7
  Inner1 w0.127: v1(4.83,19.43) 4.83,17.27 4.27,16.72 4.27,11.6 5.84,10.03 10.29,10.03 12.15,8.17 v1(15.64,8.17) 32.17,8.17 32.77,8.76 41.15,8.76 41.28,8.64 48.9,8.64 49.02,8.76 75.82,8.76 77.39,10.33 81,10.33 v1(81.44,9.89)
  Bottom Layer w0.127: v1(15.64,8.17) 15.35,7.87 8.13,7.87 6.48,6.22 6.48,2.68 7.12,2.03 18.74,2.03 v1(19.05,1.72)
G0: length 40.2
  Top Layer w0.127: v1(70.13,3.68) 69.98,3.84 69.98,7.54 66.97,10.54 65.12,10.54 65.07,10.59
  Bottom Layer w0.127: v1(97.28,0.63) 97.28,1.02 92.96,5.33 71.63,5.33 70.13,3.84 v1(70.13,3.68)
G1: length 32.7
  Top Layer w0.127: U80.4 67.58,12 72.54,7.04 v1(72.54,3.53)
  Bottom Layer w0.127: v1(72.54,3.53) 72.54,3.7 73.41,4.57 87.25,4.57 90.68,1.14 v1(90.68,0.63)
G2: length 25.4
  Top Layer w0.127: v1(75.06,3.56) 74.8,3.82 74.8,6.89 68.2,13.5 U80.7
  Bottom Layer w0.127: v1(83.82,0.63) 83.82,1.4 81.91,3.3 75.32,3.3 v1(75.06,3.56)
G3: length 33
  Top Layer w0.127: v1(55.07,3.78) 54.95,3.9 54.95,9.02 55.07,9.14 56.26,9.14 57,9.88 U81.2
  Bottom Layer w0.127: v1(55.07,3.78) 56.15,4.85 66.4,4.85 68.57,2.68 69.72,2.68 69.94,2.46 76.54,2.46 77.47,1.52 v1(77.47,0.53)
G4: length 27.6
  Top Layer w0.127: U81.5 58.5,9.67 58.95,9.22 60.75,9.22 61.09,8.89 61.09,4.95 60.32,4.19 57.83,4.19 v1(56.96,3.32)
  Bottom Layer w0.127: v1(56.96,3.32) 57.8,4.16 65.56,4.16 67.73,1.99 69.43,1.99 69.56,1.87 69.56,1.81 v1(70.74,0.63)
G5: length 33.7
  Top Layer w0.127: v1(42.03,3.46) 42.29,3.72 42.29,4.32 42.67,4.7 42.67,8.32 43.52,9.17 43.52,11.13 43.99,11.61 44.58,11.61 U82.15
  Bottom Layer w0.127: v1(64.13,0.65) 64.13,0.89 62.36,2.67 58.39,2.67 58.18,2.88 54.66,2.88 54.29,3.25 54.28,3.25 54.15,3.38 50.85,3.38 50.42,3.81 47.69,3.81 47.36,4.14 44.09,4.14 43.51,3.57 43.12,3.57 43.02,3.46 v1(42.03,3.46)
G6: length 21.9
  Top Layer w0.127: U82.3 45.2,8.25 44.45,7.49 44.45,4.32 44.07,3.94 44.07,2.73 v1(44.07,2.73)
  Bottom Layer w0.127: v1(44.07,2.73) 44.11,2.73 44.5,3.12 44.76,3.12 45.05,3.4 46.92,3.4 47.25,3.07 47.6,3.07 47.62,3.05 50.04,3.05 50.47,2.62 53.83,2.62 54.42,2.03 56.31,2.03 57.53,0.81 57.53,0.63
G7: length 13.4
  Top Layer w0.127: v1(45.86,2.29) 45.86,3.22 45.89,3.25 45.89,6.14 46.7,6.95 U82.6
  Bottom Layer w0.127: v1(45.86,2.29) 46.28,2.7 46.65,2.7 47.07,2.29 49.53,2.29 50.76,1.06 50.76,0.67 v1(50.8,0.63)
G8: length 6.4
  Top Layer w0.127: v1(40.42,5.08) 40.42,4.85 U83.1
  Bottom Layer w0.127: v1(40.42,5.08) 40.61,4.9 40.61,2.96 41.53,2.03 43.05,2.03 v1(43.56,1.52)
G9: length 7
  Top Layer w0.127: v1(38.73,6.36) 38.73,5.48 U83.4
  Bottom Layer w0.127: v1(38.73,6.36) 38.83,6.26 38.83,5.48 39.24,5.06 39.24,3.61 38.83,3.19 38.83,2.38 v1(37.59,1.14)
NRST: length 101.6
  Top Layer w0.127: R115.1 28.96,13.1 v1(27.82,11.96) 27.76,11.9 C61.2 27.56,11.3 27.38,11.13 27.38,9.45 U88.7 ; v1(24.44,12.36) 24.44,12.59 24.56,12.72 24.56,13.41 24,13.97 23.25,13.97 20.84,16.38 13.39,16.38 12.25,17.53 RESET.1
  Inner1 w0.127: v1(98.14,15) 95.46,12.32 65.88,12.32 65.63,12.07 64.39,12.07 64.13,12.32 62.74,12.32 62.41,12 59.51,12 59.18,12.32 55.65,12.32 55.19,11.86 53.02,11.86 52.84,11.68 49.78,11.68 48.46,13 43.1,13 42.16,12.07 39.24,12.07 38.99,12.32 33.45,12.32 33.19,12.57 28.43,12.57 v1(27.82,11.96) 25.38,11.96 24.89,12.45 24.53,12.45 v1(24.44,12.36)
PWR0: length 39.8
  Top Layer w0.127: v1(64.58,15.88) 64.23,15.88 U84.15
  Bottom Layer w0.127: v1(99.06,24.88) 99.42,24.52 99.42,24.49 96.01,21.08 92.58,21.08 89,17.5 69.45,17.5 67.31,15.37 65.09,15.37 v1(64.58,15.88)
PWR1: length 35.4
  Top Layer w0.127: U84.1 65.52,16.75 66.4,17.63 v1(67.78,17.63)
  Bottom Layer w0.127: v1(67.78,17.63) 68.56,17.63 68.83,17.91 88.39,17.91 92.33,21.84 94.74,21.84 97.28,24.38 v1(97.28,24.77)
PWR2: length 32.6
  Top Layer w0.127: 65.66,17.71 65.66,17.78 66.17,18.29 v1(67.78,18.29)
  Bottom Layer w0.127: v1(67.78,18.29) 87.76,18.29 91.95,22.48 93.22,22.48 95,24.26 v1(95,24.77)
PWR3: length 31.1
  Top Layer w0.127: U84.3 65.28,18.19 65.88,18.8 68.35,18.8 68.42,18.73 v1(68.79,18.73)
  Bottom Layer w0.127: v1(92.96,24.77) 92.96,24 91.95,22.99 91.31,22.99 87.05,18.73 v1(68.79,18.73)
PWR4: length 29.4
  Top Layer w0.127: v1(69.72,19.3) 65.78,19.3 64.89,18.41 U84.4
  Bottom Layer w0.127: v1(91.06,24.75) 91.06,23.75 86.61,19.3 v1(69.72,19.3)
PWR5: length 28.5
  Top Layer w0.127: v1(70.76,19.74) 65.46,19.74 64.51,18.79 64.51,18.68
  Bottom Layer w0.127: v1(70.76,19.74) 86.16,19.74 89.28,22.86 v1(89.28,24.77)
PWR6: length 27
  Top Layer w0.127: U84.6 64.13,19.16 65.27,20.3 v1(71.58,20.3)
  Bottom Layer w0.127: v1(87,24.75) 87,21.84 85.46,20.3 v1(71.58,20.3)
PWR7: length 24.8
  Top Layer w0.127: U84.7 63.74,19.5 66.29,22.04 v1(84.39,22.04)
  Bottom Layer w0.127: v1(84.96,24.77) 84.96,22.73 84.39,22.16 v1(84.39,22.04)
PWR8: length 27.5
  Top Layer w0.127: 58.94,18.45 59.06,18.45 v1(59.41,18.1)
  Bottom Layer w0.127: v1(83.19,24.77) 83.19,24.26 80.77,21.84 69.63,21.84 67.47,19.69 61.8,19.69 61.54,19.43 60.74,19.43 v1(59.41,18.1)
PWR9: length 24.1
  Top Layer w0.127: v1(60.79,19.87) 60.56,19.63 59.81,19.63 U85.1
  Bottom Layer w0.127: v1(81.03,24.75) 81.03,24.13 78.99,22.1 69.47,22.1 67.31,19.94 60.86,19.94 v1(60.79,19.87)
PWR10: length 21.7
  Top Layer w0.127: v1(60.41,20.5) 59.61,20.5 U85.2
  Bottom Layer w0.127: v1(79.25,24.75) 76.85,22.35 69.22,22.35 67.18,20.32 60.59,20.32 v1(60.41,20.5)
PWR11: length 20.7
  Top Layer w0.127: U85.3 59.01,20.79 59.27,21.04 60.72,21.04 v1(60.84,20.92)
  Bottom Layer w0.127: v1(77.34,24.77) 77.34,24.38 75.56,22.61 68.83,22.61 66.93,20.7 61.37,20.7 61.21,20.86 61.19,20.86 61.13,20.92 v1(60.84,20.92)
PWR12: length 19.1
  Top Layer w0.127: U85.4 58.55,20.72 58.55,20.83 59.06,21.34 60.45,21.34 60.58,21.46 61.23,21.46 v1(61.45,21.24)
  Bottom Layer w0.127: v1(75.31,24.77) 75.31,24.38 73.79,22.86 68.58,22.86 66.8,21.08 61.75,21.08 61.59,21.24 v1(61.45,21.24)
PWR13: length 17.4
  Top Layer w0.127: v1(64.29,21.65) 64.22,21.72 60.45,21.72 60.32,21.59 58.55,21.59 58.08,21.12 58.08,20.89 U85.5
  Bottom Layer w0.127: v1(64.29,21.65) 64.35,21.59 66.8,21.59 68.38,23.17 72.19,23.17 73.28,24.26 v1(73.28,24.77)
PWR14: length 15.7
  Top Layer w0.127: U85.6 57.6,21.23 58.21,21.84 60.07,21.84 60.39,22.16 v1(62.29,22.16)
  Bottom Layer w0.127: v1(71.25,24.77) 71.25,24.13 70.51,23.4 68.1,23.4 66.93,22.23 62.35,22.23 v1(62.29,22.16)
PWR15: length 13.8
  Top Layer w0.127: v1(63.32,22.67) 63.26,22.73 60.58,22.73 59.93,22.09 57.95,22.09 57.14,21.28 57.14,21.23 U85.7
  Bottom Layer w0.127: v1(63.32,22.67) 63.38,22.61 66.8,22.61 67.83,23.64 68.34,23.64 69.09,24.38 v1(69.09,24.77)
PWR16: length 16.7
  Top Layer w0.127: 53.36,19.56 53.73,19.56 v1(53.79,19.62)
  Bottom Layer w0.127: v1(53.79,19.62) 54.05,19.35 54.36,19.35 54.86,19.86 54.86,20.65 56.48,22.27 61.51,22.27 62.36,23.11 65.52,23.11 v1(67.18,24.77)
PWR17: length 13
  Top Layer w0.127: v1(54.23,21.46) 54.23,21.33 U86.1
  Bottom Layer w0.127: v1(65.15,24.77) 63.75,23.37 62.1,23.37 61.32,22.58 56.24,22.58 55.12,21.46 v1(54.23,21.46)
PWR18: length 10.9
  Top Layer w0.127: v1(53.71,21.86) 53.7,21.87 U86.2
  Bottom Layer w0.127: v1(53.71,21.86) 54,21.86 54.05,21.9 54.41,21.9 54.46,21.86 55.07,21.86 56.1,22.89 61.11,22.89 62.99,24.77 v1(63.12,24.77)
PWR19: length 9.3
  Top Layer w0.127: 52.98,21.9 53.09,22 53.09,22.44 53.15,22.51 v1(53.97,22.51)
  Bottom Layer w0.127: v1(53.97,22.51) 55.4,22.51 56.01,23.11 59.18,23.11 59.41,23.34 59.41,23.35 v1(60.83,24.77)
PWR20: length 7.4
  Top Layer w0.127: v1(52.53,22.44) 52.53,22.37 52.61,22.29 52.61,22.05 U86.4
  Bottom Layer w0.127: v1(52.53,22.44) 52.53,22.51 52.97,22.95 55.5,22.95 55.96,23.41 57.24,23.41 57.52,23.69 57.52,24.37 v1(57.91,24.77)
PWR21: length 5.5
  Top Layer w0.127: U86.5 52.07,22.04 52.07,22.62 v1(51.95,22.74)
  Bottom Layer w0.127: v1(51.95,22.74) 52.39,23.18 55.22,23.18 v1(56.04,24.01)
PWR22: length 5.1
  Top Layer w0.127: U86.6 51.35,22.1 51.35,22.41 51.33,22.44 v1(51.33,22.97)
  Bottom Layer w0.127: v1(51.33,22.97) 51.77,23.41 53.38,23.41 54.36,24.38 v1(54.36,24.77)
PWR23: length 4.2
  Top Layer w0.127: U86.7 50.93,22.05 50.93,22.61 v1(50.55,22.99)
  Bottom Layer w0.127: v1(52.83,24.77) 52.68,24.77 51.92,24 51.74,24 50.72,22.99 v1(50.55,22.99)
PWR24: length 7.6
  Top Layer w0.127: 47.05,18.98 47.77,18.98 v1(48.16,19.38)
  Bottom Layer w0.127: v1(48.16,19.38) 48.16,20.35 49.78,21.97 49.78,24.27 v1(50.29,24.77)
PWR25: length 4.7
  Top Layer w0.127: U87.1 47.46,20.55 v1(47.46,21.42)
  Bottom Layer w0.127: v1(47.46,21.42) 48.26,22.23 v1(48.26,24.77)
PWR26: length 3.7
  Top Layer w0.127: 46.85,21.29 46.96,21.41 v1(46.96,21.97)
  Bottom Layer w0.127: v1(46.96,21.97) 46.96,22.25 46.56,22.65 v1(46.56,24.77)
PWR27: length 3.3
  Top Layer w0.127: v1(46.33,22.07) 46.35,22.05 46.35,21.25
  Bottom Layer w0.127: v1(46.33,22.07) 46.26,22.07 44.74,23.6 v1(44.74,23.88)
PWR28: length 4.3
  Top Layer w0.127: v1(45.7,22.01) 45.85,21.86 U87.4
  Bottom Layer w0.127: v1(45.7,22.01) 45.7,22.07 44.91,22.86 43.81,22.86 v1(42.97,23.71)
PWR29: length 7.5
  Top Layer w0.127: v1(45.1,21.84) 45.1,21.63 45.24,21.49 45.24,21.28 U87.5
  Bottom Layer w0.127: v1(39.92,24.77) 39.92,24.21 40.89,23.24 42.42,23.24 43.34,22.32 44.62,22.32 v1(45.1,21.84)
PWR30: length 9.1
  Top Layer w0.127: v1(43.71,21.72) 44.26,21.72 44.34,21.63 44.56,21.63 44.74,21.45 44.74,21.23 U87.6
  Bottom Layer w0.127: v1(37.97,24.77) 37.97,23.75 38.48,23.24 40.39,23.24 40.64,22.99 42.04,22.99 42.93,22.09 43.33,22.09 v1(43.71,21.72)
PWR31: length 10.7
  Top Layer w0.127: 44.36,21.08 44.29,21.14 v1(43.31,21.14)
  Bottom Layer w0.127: v1(36.07,24.77) 36.07,23.37 36.45,22.99 40.26,22.99 40.51,22.73 41.78,22.73 43.31,21.21 v1(43.31,21.14)
PWR32: length 12.8
  Top Layer w0.127: U90.15 41.47,18.92 v1(42.04,18.92)
  Bottom Layer w0.127: v1(42.04,18.92) 41.91,19.05 41.91,20.99 40.16,22.73 35.43,22.73 35.09,23.08 35.09,23.72 v1(34.04,24.77)
PWR33: length 11.9
  Top Layer w0.127: v1(41.15,20.83) 41.2,20.78 U90.1
  Bottom Layer w0.127: v1(41.15,20.83) 41.15,21.27 39.94,22.48 35.18,22.48 34.25,23.41 33.19,23.41 33.06,23.53 33.06,23.82 v1(32,24.88)
PWR34: length 11.8
  Top Layer w0.127: U90.2 40.5,21.19 v1(40.37,21.32)
  Bottom Layer w0.127: v1(40.37,21.32) 39.47,22.23 35.05,22.23 34.1,23.18 30.8,23.18 30.36,23.61 v1(30.36,24.01)
PWR35: length 13
  Top Layer w0.127: v1(39.67,21.36) 39.67,21.15 40.03,20.8 40.03,20.76 U90.3
  Bottom Layer w0.127: v1(39.67,21.36) 39.07,21.97 34.93,21.97 33.95,22.95 28.99,22.95 28.54,23.4 v1(28.54,23.63)
PWR36: length 16.2
  Top Layer w0.127: v1(38.97,21.42) 38.97,21.13 39.12,20.98 39.2,20.98 39.56,20.63 39.56,20.59 39.56,20.58
  Bottom Layer w0.127: v1(25.57,24.77) 25.57,24.34 27.19,22.72 33.8,22.72 34.8,21.72 38.68,21.72 v1(38.97,21.42)
PWR37: length 17.8
  Top Layer w0.127: v1(38.44,21.08) 38.44,20.99 38.62,20.81 38.73,20.81 39.09,20.46 39.09,20.42 39.09,20.41
  Bottom Layer w0.127: v1(23.75,24.88) 23.75,24 25.27,22.48 33.66,22.48 34.67,21.46 38.06,21.46 v1(38.44,21.08)
PWR38: length 19.1
  Top Layer w0.127: U90.6 38.62,20.25 38.62,20.29 38.26,20.64 38.05,20.64 v1(37.67,21.02)
  Bottom Layer w0.127: v1(37.67,21.02) 37.49,21.21 34.54,21.21 33.53,22.23 23.75,22.23 21.84,24.13 v1(21.84,24.77)
PWR39: length 20.5
  Top Layer w0.127: 38.16,20.07 37.81,20.41 37.43,20.41 v1(37.41,20.44)
  Bottom Layer w0.127: v1(37.41,20.44) 36.89,20.96 34.42,20.96 33.38,22 22.4,22 19.69,24.71 v1(19.69,24.77)
PWR40: length 23.9
  Top Layer w0.127: U91.15 v1(36.63,17.06)
  Bottom Layer w0.127: v1(17.78,24.77) 17.78,24.59 20.6,21.77 33.22,21.77 34.26,20.73 34.9,20.73 36.7,18.92 36.7,17.14 v1(36.63,17.06)
PWR41: length 23.5
  Top Layer w0.127: 35.65,18.02 35.43,18.24 35.43,18.88 v1(33.11,21.2)
  Bottom Layer w0.127: v1(15.43,24.88) 15.46,24.88 18.87,21.46 32.89,21.46 33.11,21.24 v1(33.11,21.2)
PWR42: length 24.2
  Top Layer w0.127: U91.2 34.04,19.18 34.04,19.39 v1(32.43,20.99)
  Bottom Layer w0.127: v1(32.43,20.99) 32.09,20.99 31.88,21.21 16.38,21.21 14.1,23.5 14.1,24.49 13.9,24.68 v1(13.9,24.7)
PWR43: length 26.2
  Top Layer w0.127: U91.3 34.29,18.13 v1(32.01,20.42)
  Bottom Layer w0.127: v1(11.2,24.77) 11.2,24.36 14.58,20.98 31.45,20.98 v1(32.01,20.42)
PWR44: length 27.4
  Top Layer w0.127: v1(31.28,20.44) 31.36,20.44 U91.4
  Bottom Layer w0.127: v1(31.28,20.44) 30.97,20.75 13.49,20.75 9.78,24.46 v1(9.78,24.88)
PWR45: length 29.1
  Top Layer w0.127: v1(30.63,20.31) 30.73,20.21 30.73,20.2 32.64,18.29 32.81,18.29 U91.5
  Bottom Layer w0.127: v1(30.63,20.31) 30.42,20.52 11.69,20.52 7.56,24.65 v1(7.49,24.65)
PWR46: length 31
  Top Layer w0.127: U91.6 32.74,17.65 32.48,17.65 30.2,19.93 v1(29.97,19.93)
  Bottom Layer w0.127: v1(29.97,19.93) 29.97,20.15 29.83,20.29 9.88,20.29 5.59,24.59 v1(5.59,24.77)
PWR47: length 34.5
  Top Layer w0.127: U91.7 32.84,16.97 32.54,17.27 32,17.27 29.56,19.72 v1(29.24,19.72)
  Bottom Layer w0.127: v1(29.24,19.72) 29.24,19.85 29.32,19.94 5.6,19.94 3.81,21.73 3.81,24.52 v1(3.56,24.77)
R0: length 45.2
  Top Layer w0.127: U80.15 63.63,10.96 63.63,9.77 63.61,9.76 63.61,8.64 63.74,8.51 68.07,8.51 69.33,7.25 v1(69.33,3.81)
  Bottom Layer w0.127: v1(99.31,0.63) 99.31,1.02 94.74,5.59 70.99,5.59 69.33,3.92 v1(69.33,3.81)
R1: length 35
  Top Layer w0.127: v1(71.81,3.53) 71.81,7.06 67.37,11.5 U80.3
  Bottom Layer w0.127: v1(92.84,0.63) 92.84,1.27 89.28,4.83 72.9,4.83 71.81,3.74 v1(71.81,3.53)
R2: length 27.9
  Top Layer w0.127: U80.6 67.99,13 74.19,6.8 v1(74.19,3.53)
  Bottom Layer w0.127: v1(85.98,0.63) 85.98,1.14 83.06,4.06 74.55,4.06 74.19,3.7 v1(74.19,3.53)
R3: length 36.7
  Top Layer w0.127: v1(54.47,3.8) 54.48,3.81 54.48,9.27 54.71,9.49 55.94,9.49 55.97,9.53 56.01,9.53 56.46,9.98 56.46,10.78 U81.1
  Bottom Layer w0.127: v1(79.5,0.53) 79.5,1.27 78.04,2.74 69.98,2.74 69.81,2.91 68.85,2.91 66.68,5.08 55.63,5.08 54.47,3.93 v1(54.47,3.8)
R4: length 31.4
  Top Layer w0.127: v1(56.28,3.52) 56.54,3.52 57.59,4.57 60.2,4.57 60.83,5.21 60.83,8.76 60.71,8.89 58.54,8.89 57.85,9.58 57.85,9.86 U81.4
  Bottom Layer w0.127: v1(72.77,0.63) 72.77,1.27 72.05,1.99 69.75,1.99 69.53,2.22 68.01,2.22 65.84,4.39 57.16,4.39 v1(56.28,3.52)
R5: length 21.5
  Top Layer w0.127: v1(58.39,3.29) 60.57,3.29 61.85,4.57 61.85,8.89 60.71,10.03 59.53,10.03 U81.7
  Bottom Layer w0.127: v1(58.39,3.29) 58.78,3.68 65.02,3.68 66.04,2.67 v1(66.04,0.53)
R6: length 24.3
  Top Layer w0.127: v1(43.41,2.9) 43.64,3.13 43.64,4.15 43.94,4.45 43.94,7.75 44.7,8.51 U82.2
  Bottom Layer w0.127: v1(43.41,2.9) 43.49,2.9 44.23,3.63 47.02,3.63 47.35,3.3 50.16,3.3 50.6,2.87 53.9,2.87 53.92,2.85 53.93,2.85 54.49,2.29 56.74,2.29 v1(56.81,2.21) 56.99,2.03 58.55,2.03 59.44,1.14 59.44,1.02
R7: length 15.6
  Top Layer w0.127: U82.5 46.2,7.34 45.34,6.48 45.34,2.75 v1(45.3,2.71)
  Bottom Layer w0.127: v1(52.83,0.53) 52.83,0.81 51.53,2.11 50.21,2.11 49.78,2.54 47.14,2.54 46.75,2.93 45.52,2.93 v1(45.3,2.71)
R8: length 6.7
  Top Layer w0.127: v1(41.09,3.09) 41.02,3.16 U83.15
  Bottom Layer w0.127: v1(45.72,1.52) 45.09,2.16 44.07,2.16 43.94,2.29 41.9,2.29 v1(41.09,3.09)
R9: length 5.3
  Top Layer w0.127: v1(39.27,6.02) 39.27,5.51 U83.3
  Bottom Layer w0.127: v1(39.12,1.52) 39.49,1.9 39.49,2.1 39.47,2.11 39.47,5.81 v1(39.27,6.02)
SERIN0: length 79.4
  Top Layer w0.127: v1(21.27,10.41) 21.34,10.35 21.34,10.03 22.3,9.07 22.47,9.07 ; U80.14 62.17,11.5 61.84,11.17 v1(61.84,10.16)
  Inner1 w0.127: v1(92.14,9.89) 92.01,9.89 91.01,10.9 84.76,10.9 84.51,11.15 76.18,11.15 75.56,10.54 65.66,10.54 64.9,9.78 62.6,9.78 ; 62.6,9.78 56.26,9.78 56.13,9.65 54.99,9.65 54.86,9.78 49.13,9.78 49,9.65 46.61,9.65 46.48,9.78 43.94,9.78 43.56,10.16 42.16,10.16 41.78,9.78 36.93,9.78 36.55,10.16 33.4,10.16 33,9.75 30.93,9.75 30.4,10.29 26.67,10.29 26.14,9.75 22.67,9.75 22.54,9.88 21.8,9.88 v1(21.27,10.41) ; 62.6,9.78 62.22,10.16 v1(61.84,10.16)
SHIFT: length 146.8
  Top Layer w0.127: v1(63.03,12.94) 63.09,13 U80.11 ; U91.11 34.77,15.4 35.88,14.28 v1(36.58,14.28) ; v1(39.75,17.02) 39.71,17.06 39.41,17.06 ; 62.64,17.22 62.56,17.15 62.4,17.15 62.24,16.98 62.03,16.98 61.93,16.89 v1(61.21,16.89) ; U85.11 56.8,18.87 56.8,18.46 56.32,17.97 55.91,17.97 55.84,17.91 v1(55.84,17.78) 55.5,17.78 54.99,18.29 54.11,18.29 v1(53.79,18.6) ; v1(58.86,13.15) 58.86,12.45 U81.11 ; 39.41,17.06 38.86,16.51 v1(38.61,16.51) ; 39.41,17.06 39.41,18.05 U90.11 ; U86.11 51.36,18.98 v1(51.18,18.8) ; U82.11 46.85,11.63 46.85,11.9 46.97,12.03 47.43,12.03 48.19,11.27 v1(48.35,11.27) ; U88.15 22.35,10.6 v1(22.35,10.8) ; v1(42.93,17.53) 44.2,17.53 45.06,18.39 45.06,18.81 ; U83.11 37.6,3.03 37.6,2.76 36.88,2.03 35.15,2.03 34.8,2.39 34.8,5.33 36.5,7.04 v1(36.5,11.54)
  Inner1 w0.127: v1(23.25,14.6) 23.62,14.22 26.01,14.22 26.12,14.33 27.45,14.33 27.92,13.87 35.97,13.87 36.38,14.28 v1(36.58,14.28) ; 48.45,10.67 47.37,10.67 47.12,10.41 46.23,10.41 46.07,10.25 43.9,10.25 43.74,10.41 42.04,10.41 41.78,10.16 37.88,10.16 v1(36.5,11.54) ; 48.45,10.67 48.88,10.24 54.94,10.24 55.5,10.8 55.93,10.8 56.49,10.24 61.29,10.24 61.72,10.67 v1(62.61,10.67) 62.87,10.92 75.18,10.92 75.72,11.46 93.22,11.46 94.14,10.53 v1(94.14,9.89) ; 48.45,10.67 48.35,10.76 v1(48.35,11.27)
  Bottom Layer w0.127: 61.34,16.76 v1(61.21,16.89) ; 61.34,16.76 61.58,16.53 63.12,16.53 63.69,15.96 63.69,15.62 63.44,15.38 62.11,15.38 60.45,13.72 59.18,13.72 58.93,13.46 58.93,13.24 59.02,13.15 ; 61.34,16.76 61.21,16.64 56.77,16.64 55.84,17.57 v1(55.84,17.78) ; v1(53.79,18.6) 51.38,18.6 v1(51.18,18.8) ; v1(36.5,11.54) 36.5,14.21 v1(36.58,14.28) 36.58,14.48 v1(38.61,16.51) ; 59.02,13.15 v1(58.86,13.15) ; 59.02,13.15 59.05,13.12 60.93,13.12 61.18,12.86 61.99,12.86 62.32,12.53 62.72,12.53 62.99,12.8 ; v1(23.25,14.6) 22.35,13.7 v1(22.35,10.8) ; 62.99,12.8 63.06,12.86 63.06,12.91 v1(63.03,12.94) ; 62.99,12.8 62.99,11.56 62.61,11.18 v1(62.61,10.67) ; v1(39.75,17.02) 40.26,17.53 v1(42.93,17.53)
SHOW: length 161
  Top Layer w0.127: U86.12 51.94,19.55 51.94,18.74 51.74,18.54 ; 58.42,13.21 58.42,12.13 ; 58.42,13.21 58.02,13.61 56.34,13.61 52.63,9.91 50.42,9.91 47.88,12.45 46.23,12.45 ; 58.42,13.21 58.42,13.84 59.69,15.11 61.7,15.11 ; 45.59,18.28 44.39,17.08 41.21,17.08 41.02,16.89 ; 45.59,18.28 45.6,18.29 46.01,17.87 48.73,17.87 48.9,18.03 51.24,18.03 51.74,18.54 ; 45.59,18.28 45.59,18.82 U87.12 ; 51.74,18.54 52.25,18.03 54.48,18.03 55.25,17.27 55.88,17.27 ; 61.7,16.04 60.8,16.04 60.67,16.16 56.86,16.16 55.88,17.14 55.88,17.27 ; 61.7,16.04 61.7,16.07 62.3,16.66 62.62,16.66 62.86,16.9 U84.12 ; 61.7,16.04 61.7,15.11 ; v1(29.56,4.84) 29.56,4.67 29.21,4.32 28.57,4.32 28.06,4.83 U88.46 ; 41.02,16.89 39.9,18.02 39.9,18.22 U90.12 ; 41.02,16.89 39.5,15.37 35.45,15.37 U91.12 ; 41.02,16.89 41.02,13.19 38.95,13.19 38.82,13.06 38.82,12.34 38.95,12.21 38.95,11.7 v1(38.61,11.36) ; 55.88,17.27 56.38,17.27 57.27,18.16 57.27,18.7 U85.12 ; 46.23,12.45 45.97,12.7 43.94,12.7 41.02,9.78 v1(41.02,7.11) ; 46.23,12.45 46.23,11.51 U82.12 ; 61.7,15.11 62.22,14.59 62.22,13.84 61.85,13.47 61.85,12.7 62.19,12.35 63.52,12.35 U80.12 ; v1(37.97,2.41) 38.23,2.67 U83.12
  Inner1 w0.127: v1(38.61,11.36) 46.47,11.36 46.92,11.81 48.51,11.81 49.66,10.67 52.8,10.67 53.31,11.18 54.8,11.18 54.93,11.05 56.9,11.05 57.28,10.67 60.71,10.67 61.16,11.12 61.16,11.21 74.2,11.21 74.8,11.81 94.22,11.81 v1(96.14,9.89)
  Bottom Layer w0.127: v1(29.56,4.84) 29.74,4.65 29.91,4.65 ; v1(41.02,7.11) 38.74,7.11 37.97,6.35 v1(37.97,2.41) 37.93,2.37 36.62,2.37 36,2.99 31.66,2.99 30.24,4.41 30.18,4.41 29.94,4.65
SWCLK: length 68.1
  Inner1 w0.127: v1(85.44,9.89) 84.41,10.92 76.71,10.92 75.95,10.16 65.6,10.16 64.99,9.55 62.7,9.55 62.57,9.42 44.86,9.42 44.53,9.09 41.96,9.09 41.63,9.42 36.55,9.42 36.36,9.62 v1(35.54,9.62) ; v1(34.93,7.37) 34.54,6.98 33.78,6.98 32.45,5.65 32.45,5.02 32.27,4.84 32.27,3.37 30.16,1.27 30.1,1.27 29.91,1.46 29.41,1.46 29.31,1.56 27.47,1.56 27.05,1.14 25.65,1.14 25.24,1.56 v1(24.89,1.56)
  Bottom Layer w0.127: v1(35.54,9.62) 35.43,9.51 35.43,7.87 v1(34.93,7.37)
SWDIO: length 67.1
  Top Layer w0.127: v1(22.61,1.71) 22.9,1.99 22.96,1.99 23.18,2.21 U88.34
  Inner1 w0.127: v1(22.61,1.71) 22.61,2.42 26.46,6.27 31.79,6.27 33.4,7.87 v1(34.04,7.87) ; v1(34.8,9.27) 34.93,9.14 41.53,9.14 41.81,8.87 45.06,8.87 45.34,9.14 63.98,9.14 64.13,8.99 66.34,8.99 66.49,9.14 75.56,9.14 77.09,10.67 82.67,10.67 v1(83.44,9.89)
  Bottom Layer w0.127: v1(34.04,7.87) 34.8,8.64 v1(34.8,9.27)
